# EAGLE design daqbeagle_shield (EAGLE 7.3.0)

## Sheet 1 of 4: BeagleBone
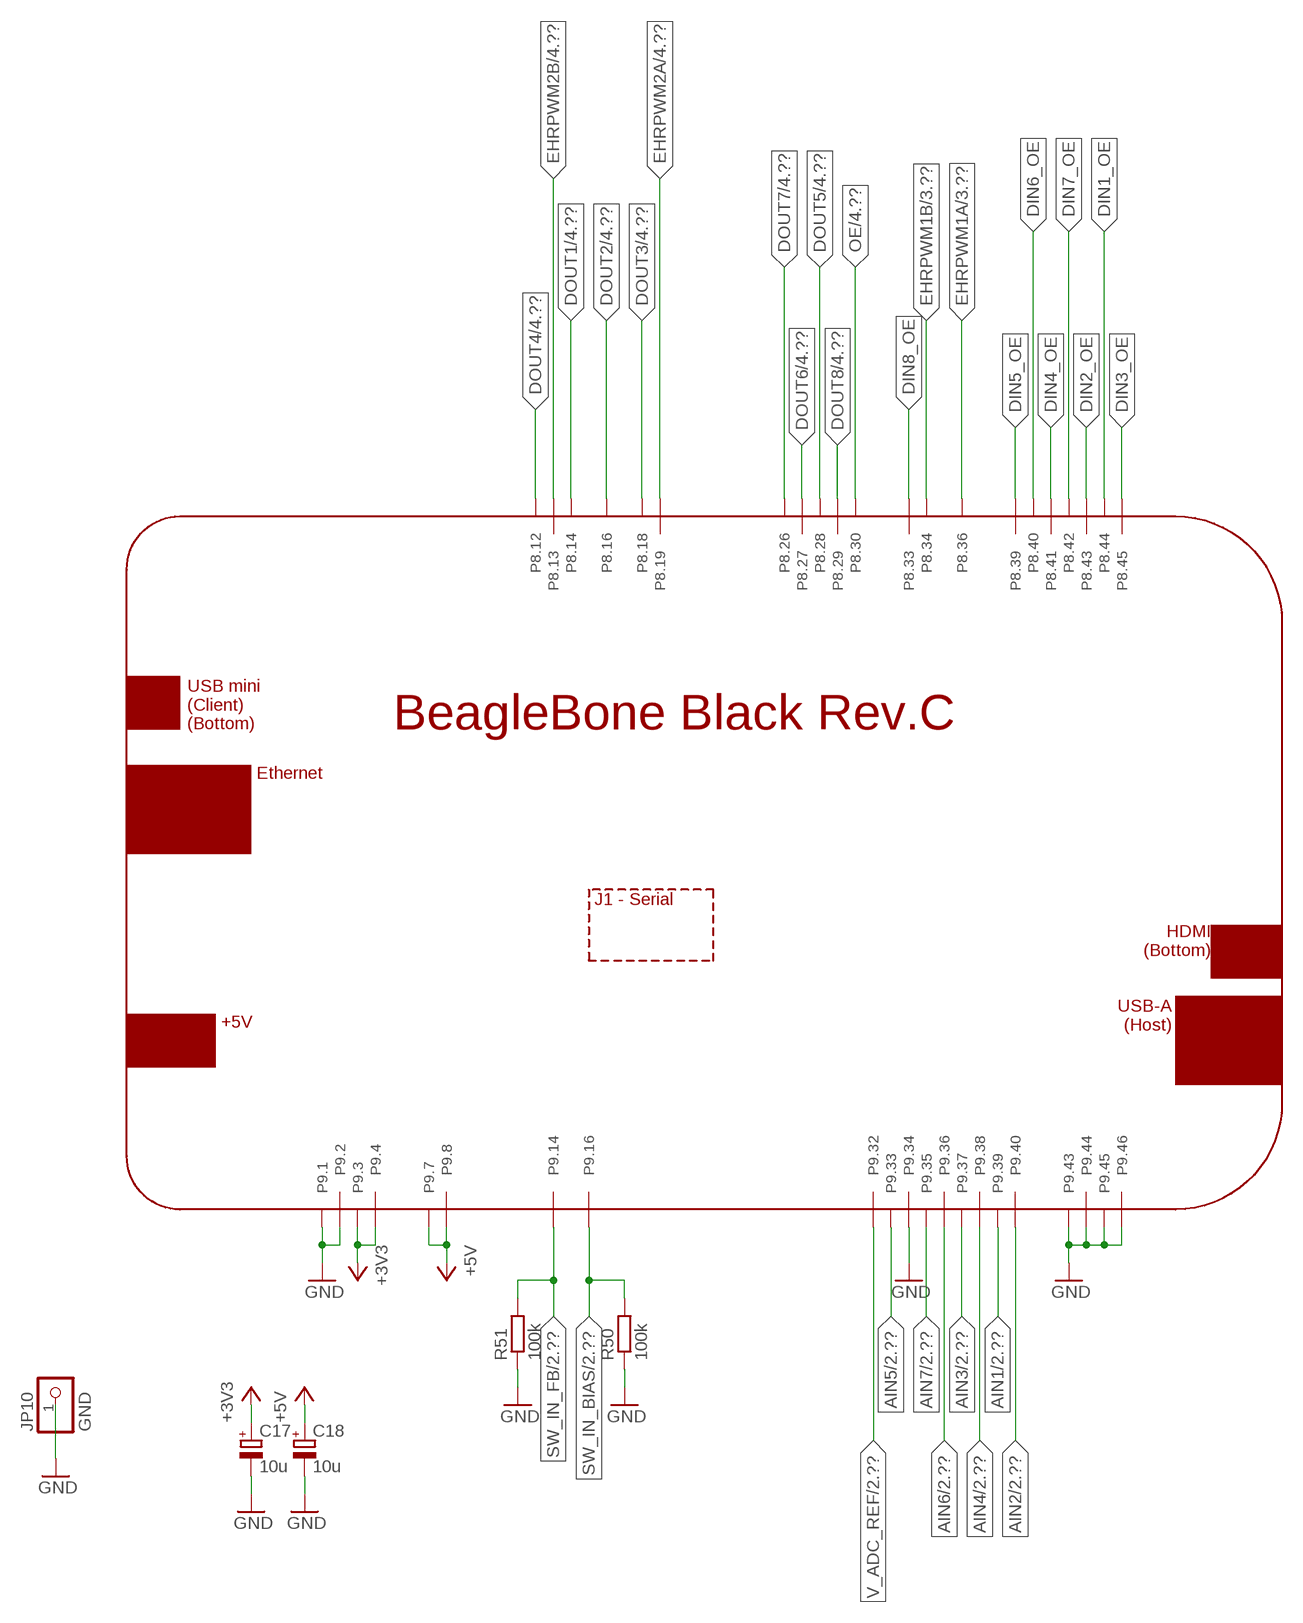
[diagram p0: schematic, sheet 1]

### Parts
C17  10u  CPOL-EUCT3216  [CT3216]
C18  10u  CPOL-EUCT6032  [CT6032]
JP10  GND  SOLDER_PAD  [PAD]
PCB1  BEAGLEBONE_BLACK  [BEAGLEBONE_BLACK]
R50  100k  R-EU_R0805  [R0805]
R51  100k  R-EU_R0805  [R0805]

### Nets
+3V3: C17.+ PCB1.P9.3 PCB1.P9.4 ; also sheet 4
+5V: C18.+ PCB1.P9.7 PCB1.P9.8 ; also sheet 2,3,4
AIN1: PCB1.P9.39 ; also sheet 2
AIN2: PCB1.P9.40 ; also sheet 2
AIN3: PCB1.P9.37 ; also sheet 2
AIN4: PCB1.P9.38 ; also sheet 2
AIN5: PCB1.P9.33 ; also sheet 2
AIN6: PCB1.P9.36 ; also sheet 2
AIN7: PCB1.P9.35 ; also sheet 2
DIN1_OE: PCB1.P8.44 ; also sheet 4
DIN2_OE: PCB1.P8.43 ; also sheet 4
DIN3_OE: PCB1.P8.45 ; also sheet 4
DIN4_OE: PCB1.P8.41 ; also sheet 4
DIN5_OE: PCB1.P8.39 ; also sheet 4
DIN6_OE: PCB1.P8.40 ; also sheet 4
DIN7_OE: PCB1.P8.42 ; also sheet 4
DIN8_OE: PCB1.P8.33 ; also sheet 4
DOUT1: PCB1.P8.14 ; also sheet 4
DOUT2: PCB1.P8.16 ; also sheet 4
DOUT3: PCB1.P8.18 ; also sheet 4
DOUT4: PCB1.P8.12 ; also sheet 4
DOUT5: PCB1.P8.28 ; also sheet 4
DOUT6: PCB1.P8.27 ; also sheet 4
DOUT7: PCB1.P8.26 ; also sheet 4
DOUT8: PCB1.P8.29 ; also sheet 4
EHRPWM1A: PCB1.P8.36 ; also sheet 3
EHRPWM1B: PCB1.P8.34 ; also sheet 3
EHRPWM2A: PCB1.P8.19 ; also sheet 4
EHRPWM2B: PCB1.P8.13 ; also sheet 4
GND: C17.- C18.- JP10.1 PCB1.P9.1 PCB1.P9.2 PCB1.P9.34 PCB1.P9.43 PCB1.P9.44 PCB1.P9.45 PCB1.P9.46 R50.1 R51.1 ; also sheet 2,3,4
OE: PCB1.P8.30 ; also sheet 4
SW_IN_BIAS: PCB1.P9.16 R50.2 ; also sheet 2
SW_IN_FB: PCB1.P9.14 R51.2 ; also sheet 2
V_ADC_REF: PCB1.P9.32 ; also sheet 2

## Sheet 2 of 4: Analog Inputs
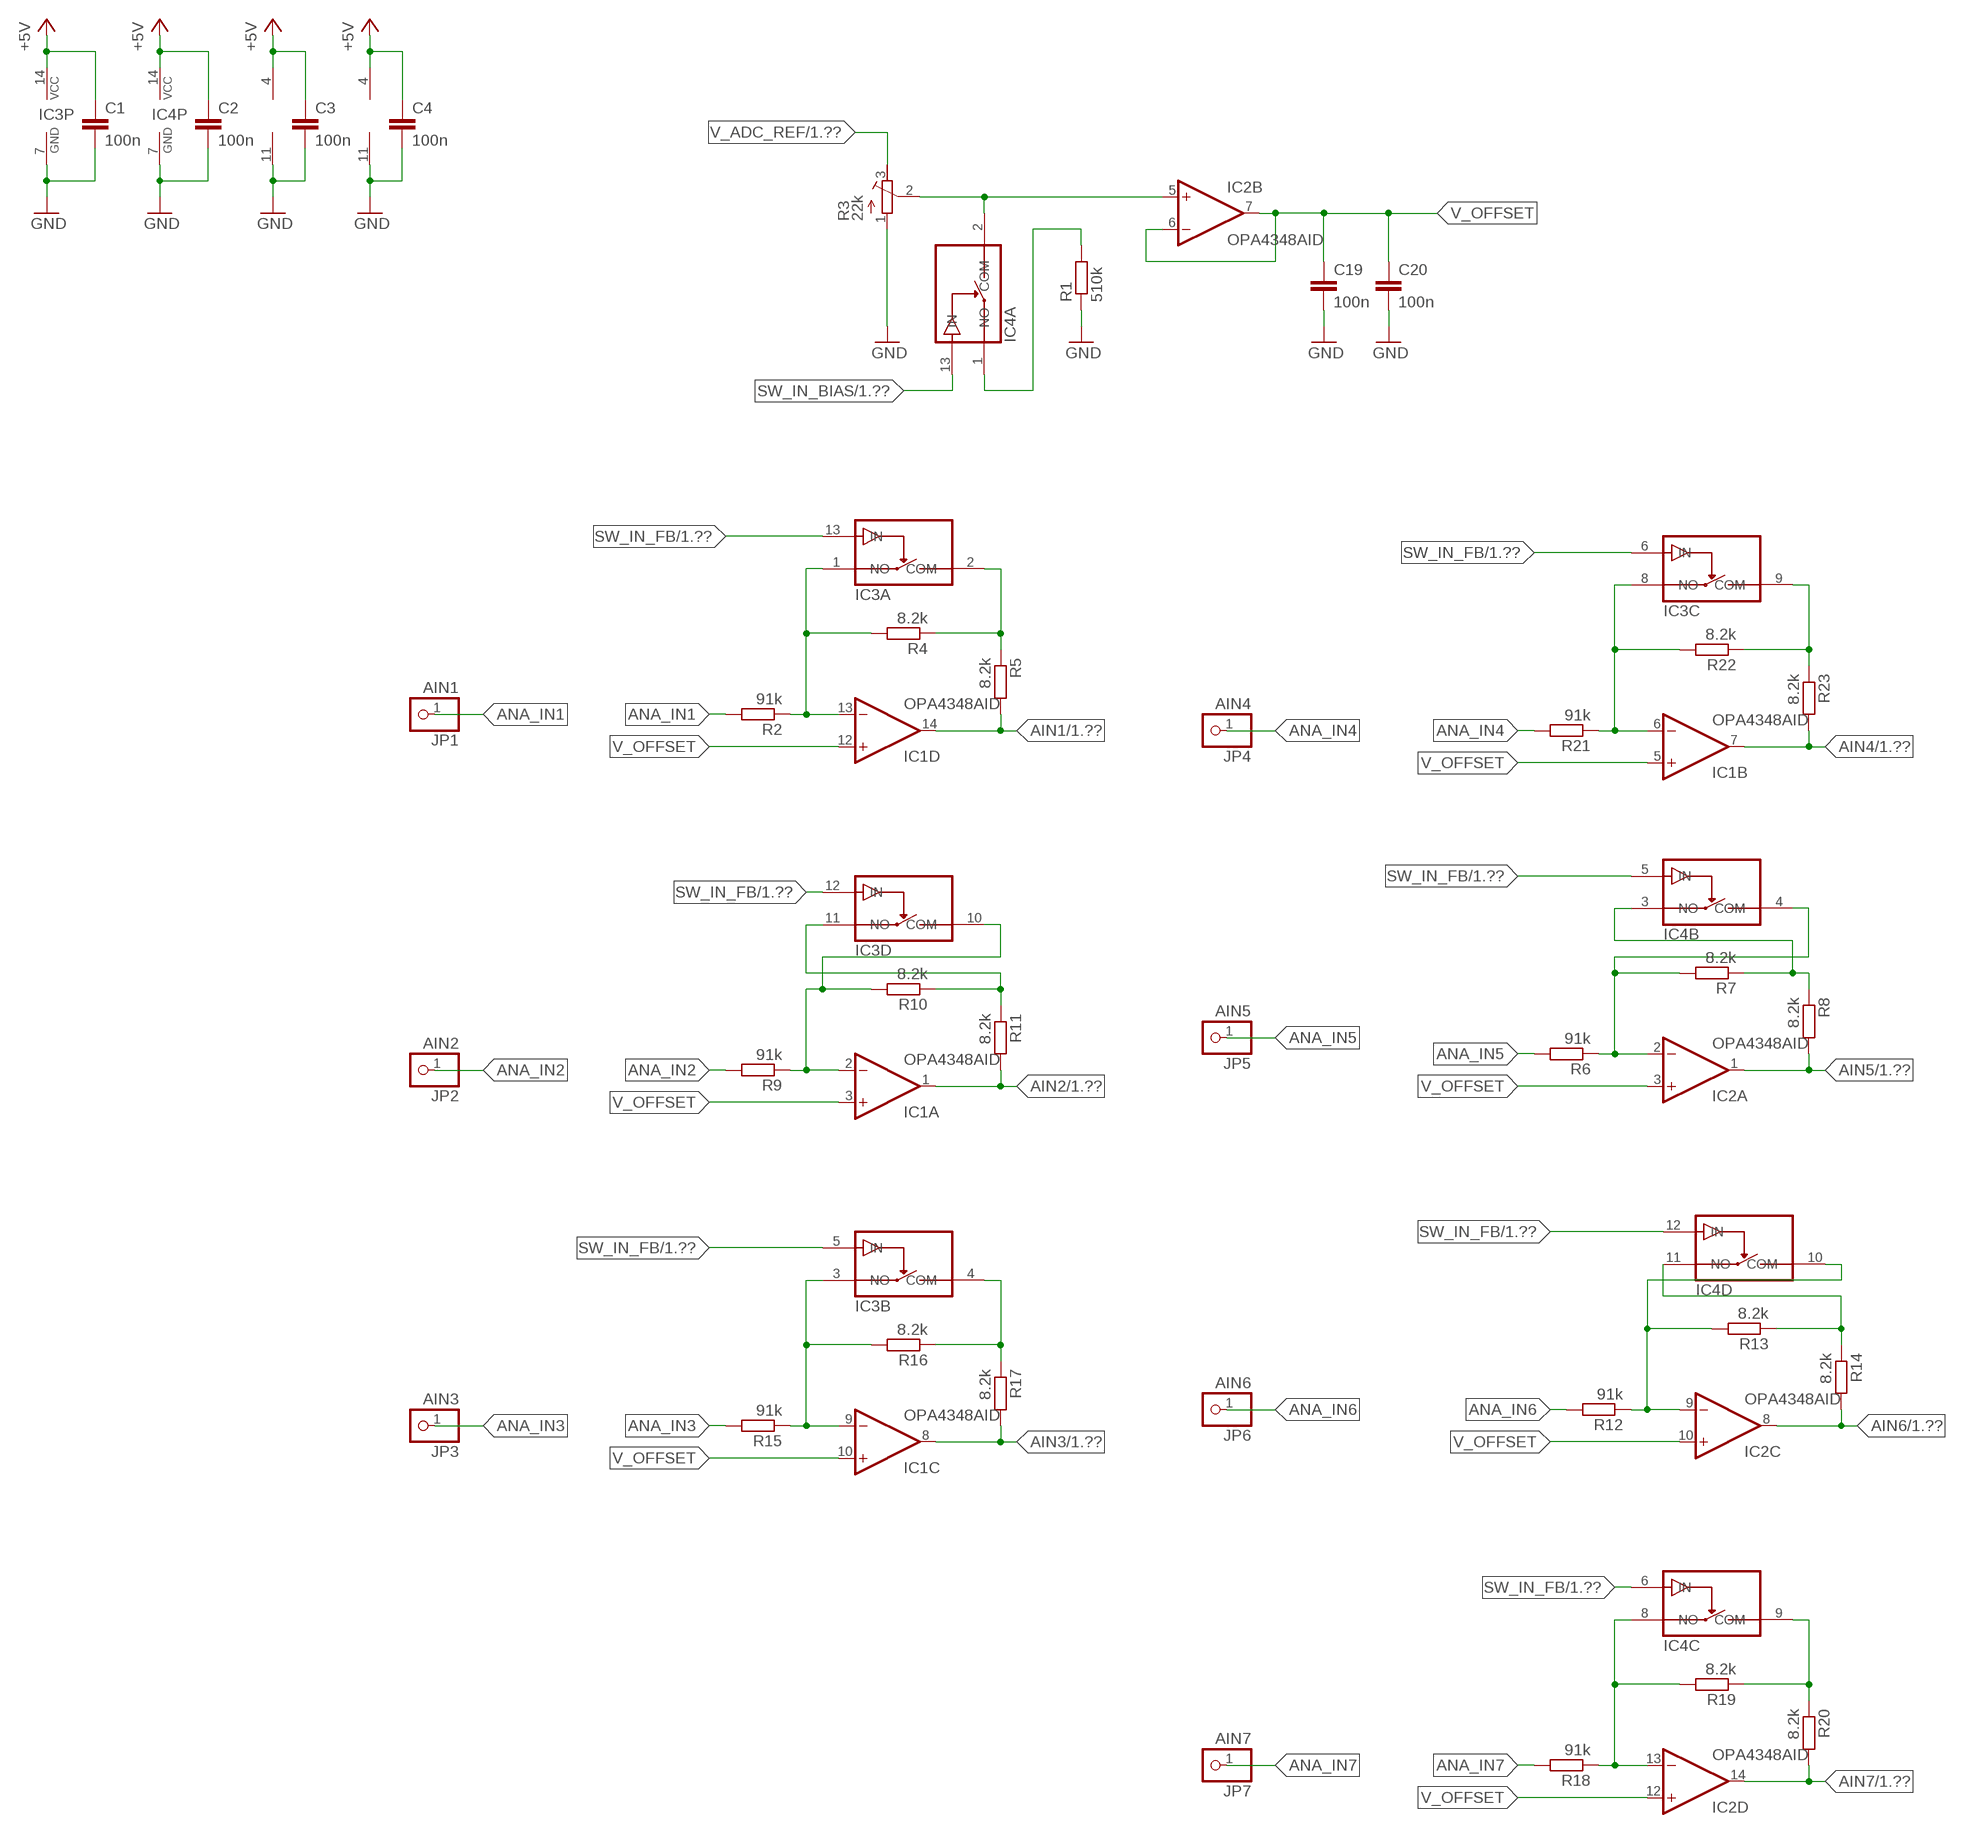
[diagram p1: schematic, sheet 2]

### Parts
C1  100n  C-EUC0805  [C0805]
C2  100n  C-EUC0805  [C0805]
C3  100n  C-EUC0805  [C0805]
C4  100n  C-EUC0805  [C0805]
C19  100n  C-EUC0805  [C0805]
C20  100n  C-EUC0805  [C0805]
IC1  OPA4348AID  [SO14]
IC2  OPA4348AID  [SO14]
IC3  TS12A44514PW  [TSSOP14]
IC4  TS12A44514PW  [TSSOP14]
JP1  AIN1  SOLDER_PAD  [PAD]
JP2  AIN2  SOLDER_PAD  [PAD]
JP3  AIN3  SOLDER_PAD  [PAD]
JP4  AIN4  SOLDER_PAD  [PAD]
JP5  AIN5  SOLDER_PAD  [PAD]
JP6  AIN6  SOLDER_PAD  [PAD]
JP7  AIN7  SOLDER_PAD  [PAD]
R1  510k  R-EU_R0603  [R0603]
R2  91k  R-EU_R0603  [R0603]
R3  22k  R-TRIMM  [RTRIM3296P]
R4  8.2k  R-EU_R0603  [R0603]
R5  8.2k  R-EU_R0603  [R0603]
R6  91k  R-EU_R0603  [R0603]
R7  8.2k  R-EU_R0603  [R0603]
R8  8.2k  R-EU_R0603  [R0603]
R9  91k  R-EU_R0603  [R0603]
R10  8.2k  R-EU_R0603  [R0603]
R11  8.2k  R-EU_R0603  [R0603]
R12  91k  R-EU_R0603  [R0603]
R13  8.2k  R-EU_R0603  [R0603]
R14  8.2k  R-EU_R0603  [R0603]
R15  91k  R-EU_R0603  [R0603]
R16  8.2k  R-EU_R0603  [R0603]
R17  8.2k  R-EU_R0603  [R0603]
R18  91k  R-EU_R0603  [R0603]
R19  8.2k  R-EU_R0603  [R0603]
R20  8.2k  R-EU_R0603  [R0603]
R21  91k  R-EU_R0603  [R0603]
R22  8.2k  R-EU_R0603  [R0603]
R23  8.2k  R-EU_R0603  [R0603]

### Nets
+5V: C1.1 C2.1 C3.1 C4.1 IC1.4(P:V+) IC2.4(P:V+) IC3.14(P:VCC) IC4.14(P:VCC) ; also sheet 1,3,4
AIN1: IC1.14(D:OUT) R5.2 ; also sheet 1
AIN2: IC1.1(A:OUT) R11.2 ; also sheet 1
AIN3: IC1.8(C:OUT) R17.2 ; also sheet 1
AIN4: IC1.7(B:OUT) R23.2 ; also sheet 1
AIN5: IC2.1(A:OUT) R8.2 ; also sheet 1
AIN6: IC2.8(C:OUT) R14.2 ; also sheet 1
AIN7: IC2.14(D:OUT) R20.2 ; also sheet 1
ANA_IN1: JP1.1 R2.2
ANA_IN2: JP2.1 R9.2
ANA_IN3: JP3.1 R15.2
ANA_IN4: JP4.1 R21.2
ANA_IN5: JP5.1 R6.2
ANA_IN6: JP6.1 R12.2
ANA_IN7: JP7.1 R18.2
GND: C1.2 C2.2 C3.2 C4.2 C19.2 C20.2 IC1.11(P:GND) IC2.11(P:GND) IC3.7(P:GND) IC4.7(P:GND) R1.1 R3.1(A) ; also sheet 1,3,4
N$1: IC2.5(B:+IN) IC4.2(A:COM) R3.2(S)
N$2: IC4.1(A:NO) R1.2
N$3: IC1.13(D:-IN) IC3.1(A:NO) R2.1 R4.2
N$4: IC2.2(A:-IN) IC4.4(B:COM) R6.1 R7.2
N$5: IC4.3(B:NO) R7.1 R8.1
N$6: IC3.2(A:COM) R4.1 R5.1
N$7: IC1.2(A:-IN) IC3.10(D:COM) R9.1 R10.2
N$8: IC3.11(D:NO) R10.1 R11.1
N$9: IC2.9(C:-IN) IC4.10(D:COM) R12.1 R13.2
N$10: IC4.11(D:NO) R13.1 R14.1
N$12: IC3.4(B:COM) R16.1 R17.1
N$13: IC2.13(D:-IN) IC4.8(C:NO) R18.1 R19.2
N$14: IC4.9(C:COM) R19.1 R20.1
N$15: IC1.6(B:-IN) IC3.8(C:NO) R21.1 R22.2
N$16: IC3.9(C:COM) R22.1 R23.1
N$99: IC1.9(C:-IN) IC3.3(B:NO) R15.1 R16.2
SW_IN_BIAS: IC4.13(A:IN) ; also sheet 1
SW_IN_FB: IC3.5(B:IN) IC3.6(C:IN) IC3.12(D:IN) IC3.13(A:IN) IC4.5(B:IN) IC4.6(C:IN) IC4.12(D:IN) ; also sheet 1
V_ADC_REF: R3.3(E) ; also sheet 1
V_OFFSET: C19.1 C20.1 IC1.3(A:+IN) IC1.5(B:+IN) IC1.10(C:+IN) IC1.12(D:+IN) IC2.3(A:+IN) IC2.6(B:-IN) IC2.7(B:OUT) IC2.10(C:+IN) IC2.12(D:+IN)

## Sheet 3 of 4: Analog Outputs
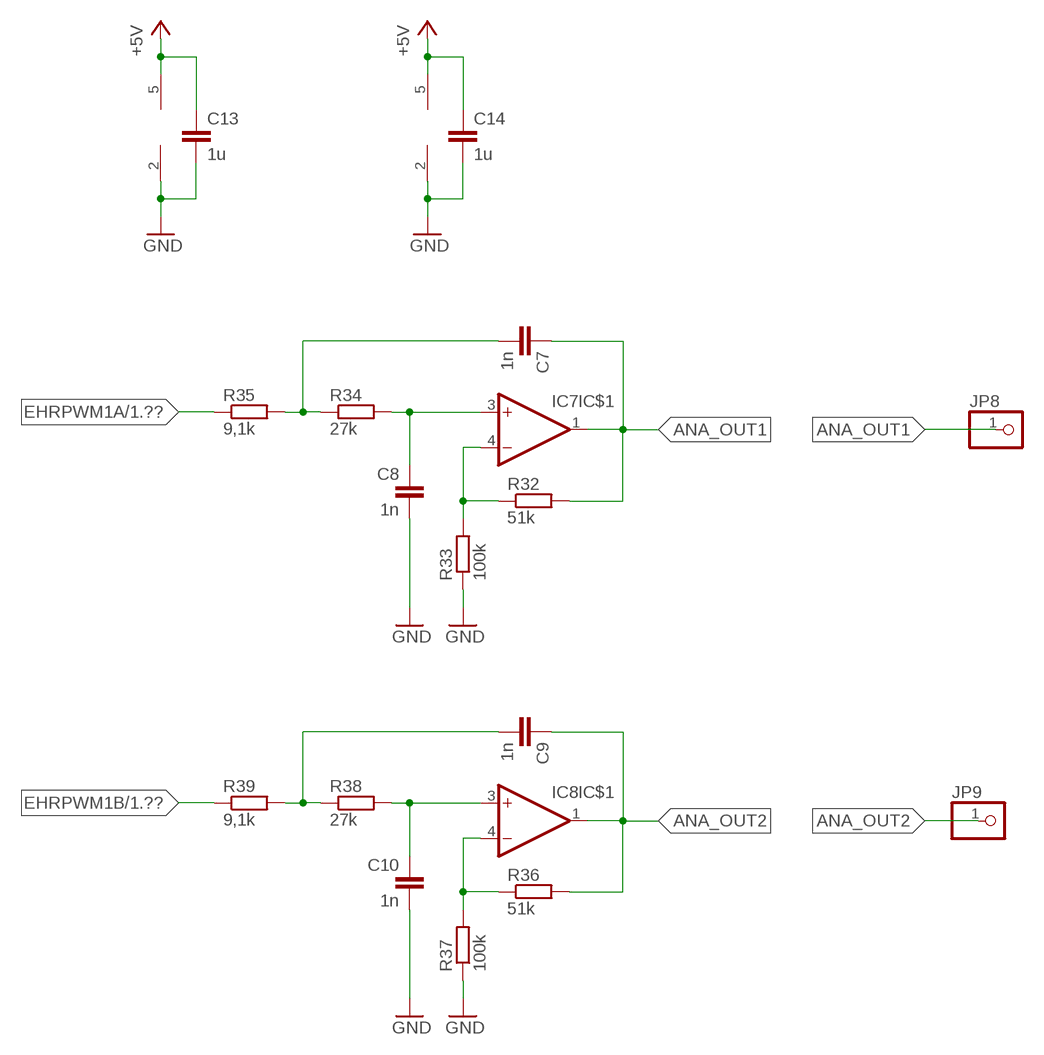
[diagram p2: schematic, sheet 3]

### Parts
C7  1n  C-EUC0805  [C0805]
C8  1n  C-EUC0805  [C0805]
C9  1n  C-EUC0805  [C0805]
C10  1n  C-EUC0805  [C0805]
C13  1u  C-EUC0805  [C0805]
C14  1u  C-EUC0805  [C0805]
IC7  OPA320  [SOT23-5L]
IC8  OPA320  [SOT23-5L]
JP8  SOLDER_PAD  [PAD]
JP9  SOLDER_PAD  [PAD]
R32  51k  R-EU_R0805  [R0805]
R33  100k  R-EU_R0603  [R0603]
R34  27k  R-EU_R0603  [R0603]
R35  9,1k  R-EU_R0805  [R0805]
R36  51k  R-EU_R0805  [R0805]
R37  100k  R-EU_R0603  [R0603]
R38  27k  R-EU_R0603  [R0603]
R39  9,1k  R-EU_R0805  [R0805]

### Nets
+5V: C13.1 C14.1 IC7.5(P:V+) IC8.5(P:V+) ; also sheet 1,2,4
ANA_OUT1: C7.1 IC7.1(IC$1:OUT) JP8.1 R32.2
ANA_OUT2: C9.1 IC8.1(IC$1:OUT) JP9.1 R36.2
EHRPWM1A: R35.1 ; also sheet 1
EHRPWM1B: R39.1 ; also sheet 1
GND: C8.2 C10.2 C13.2 C14.2 IC7.2(P:GND) IC8.2(P:GND) R33.1 R37.1 ; also sheet 1,2,4
N$25: IC7.4(IC$1:-IN) R32.1 R33.2
N$26: IC8.4(IC$1:-IN) R36.1 R37.2
N$27: C8.1 IC7.3(IC$1:+IN) R34.2
N$28: C7.2 R34.1 R35.2
N$29: C10.1 IC8.3(IC$1:+IN) R38.2
N$30: C9.2 R38.1 R39.2

## Sheet 4 of 4: Digital Inputs & Outputs / PWM Outputs
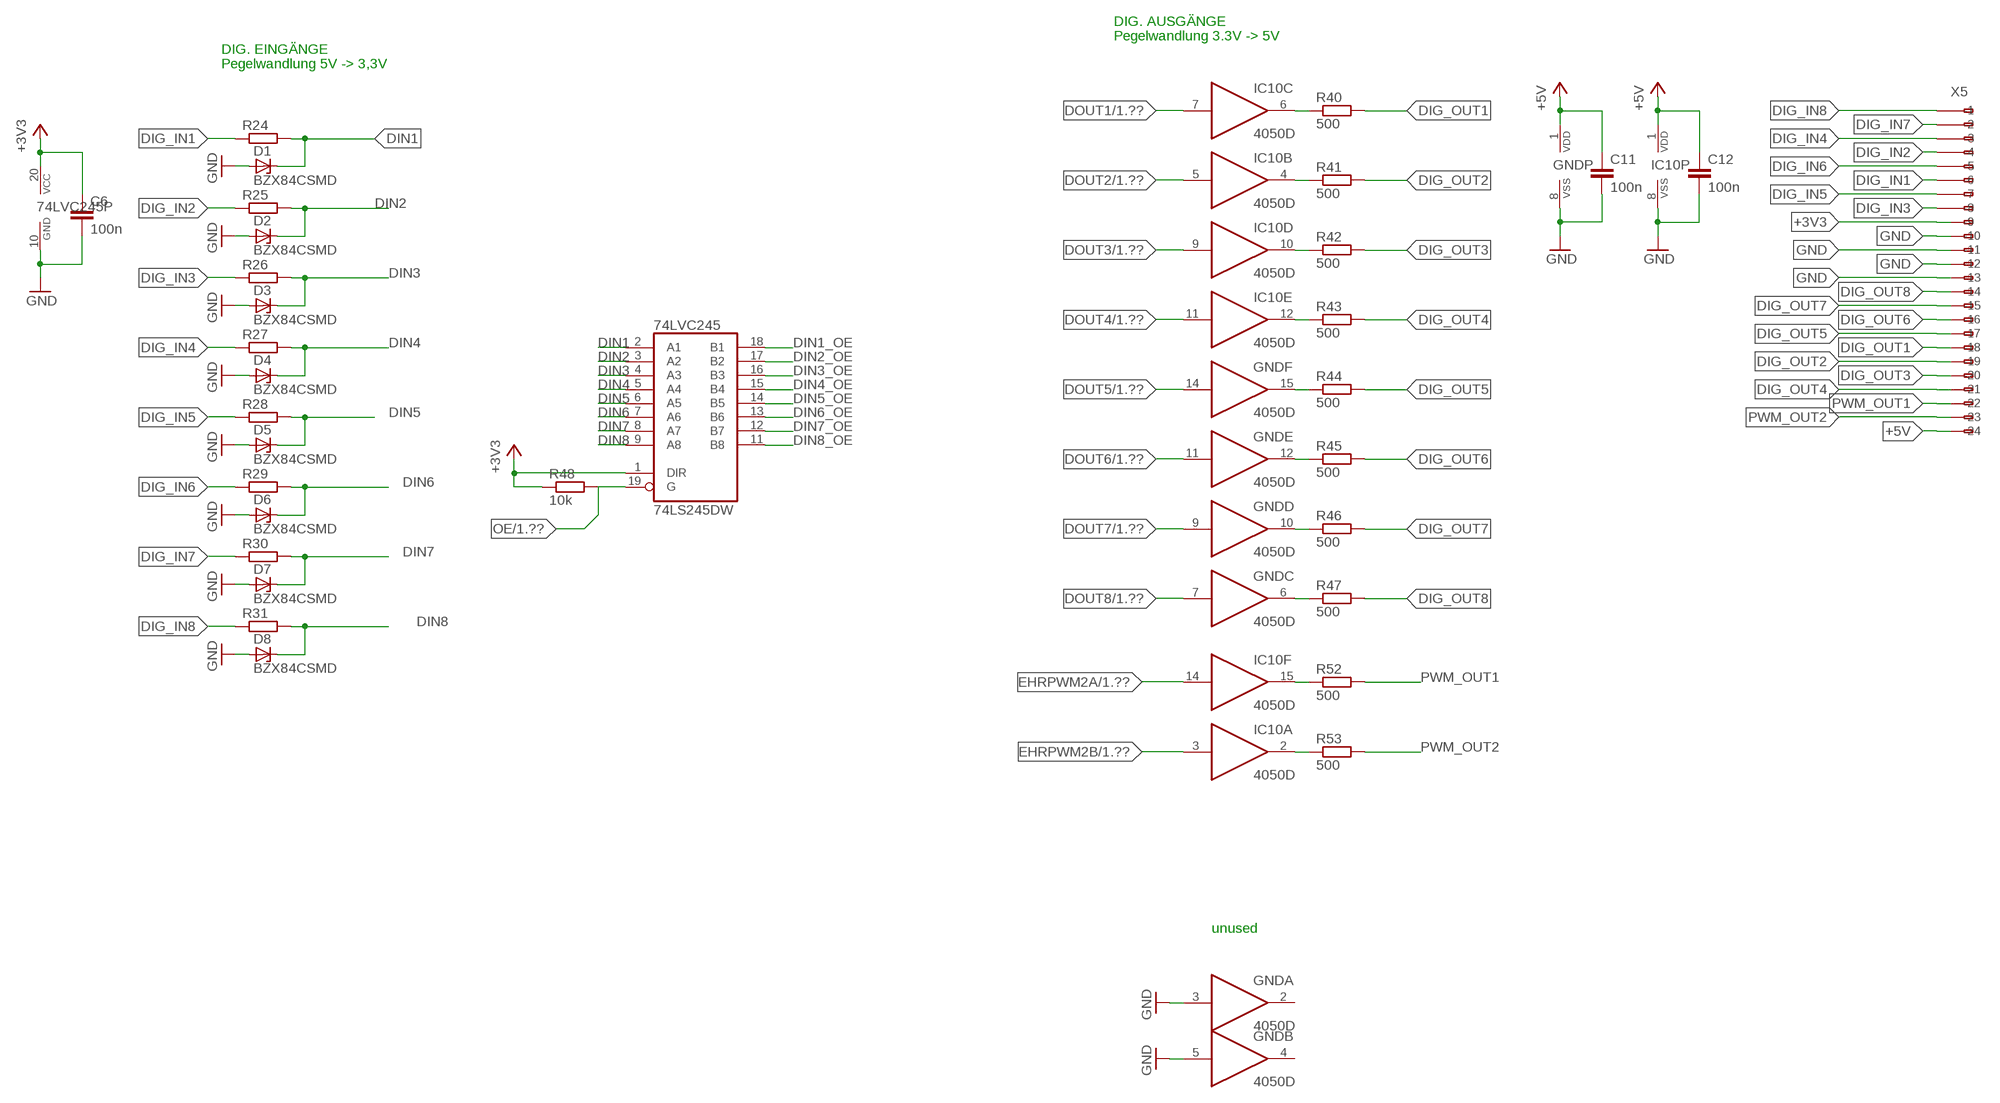
[diagram p3: schematic, sheet 4]

### Parts
74LVC245  74LS245DW  [SO20W]
C6  100n  C-EUC0805  [C0805]
C11  100n  C-EUC0805  [C0805]
C12  100n  C-EUC0805  [C0805]
D1  BZX84CSMD  [TO236]
D2  BZX84CSMD  [TO236]
D3  BZX84CSMD  [TO236]
D4  BZX84CSMD  [TO236]
D5  BZX84CSMD  [TO236]
D6  BZX84CSMD  [TO236]
D7  BZX84CSMD  [TO236]
D8  BZX84CSMD  [TO236]
GND  4050D  [SO16]
IC10  4050D  [SO16]
R24  R-EU_R0805  [R0805]
R25  R-EU_R0805  [R0805]
R26  R-EU_R0805  [R0805]
R27  R-EU_R0805  [R0805]
R28  R-EU_R0805  [R0805]
R29  R-EU_R0805  [R0805]
R30  R-EU_R0805  [R0805]
R31  R-EU_R0805  [R0805]
R40  500  R-EU_R0805  [R0805]
R41  500  R-EU_R0805  [R0805]
R42  500  R-EU_R0805  [R0805]
R43  500  R-EU_R0805  [R0805]
R44  500  R-EU_R0805  [R0805]
R45  500  R-EU_R0805  [R0805]
R46  500  R-EU_R0805  [R0805]
R47  500  R-EU_R0805  [R0805]
R48  10k  R-EU_R0805  [R0805]
R52  500  R-EU_R0805  [R0805]
R53  500  R-EU_R0805  [R0805]
X5  233-124  [233-124]

### Nets
+3V3: 74LVC245.1(DIR) 74LVC245.20(VCC) C6.1 R48.1 X5.A9(-9) X5.B9(B-9) ; also sheet 1
+5V: C11.1 C12.1 GND.1(P:VDD) IC10.1(P:VDD) X5.A24(-24) X5.B24(B-24) ; also sheet 1,2,3
DIG_IN1: R24.1 X5.A6(-6)
DIG_IN2: R25.1 X5.A4(-4)
DIG_IN3: R26.1 X5.A8(-8)
DIG_IN4: R27.1 X5.A3(-3)
DIG_IN5: R28.1 X5.A7(-7)
DIG_IN6: R29.1 X5.A5(-5)
DIG_IN7: R30.1 X5.A2(-2)
DIG_IN8: R31.1 X5.A1(-1)
DIG_OUT1: R40.2 X5.A18(-18) X5.B18(B-18)
DIG_OUT2: R41.2 X5.A19(-19) X5.B19(B-19)
DIG_OUT3: R42.2 X5.A20(-20) X5.B20(B-20)
DIG_OUT4: R43.2 X5.A21(-21) X5.B21(B-21)
DIG_OUT5: R44.2 X5.A17(-17) X5.B17(B-17)
DIG_OUT6: R45.2 X5.A16(-16) X5.B16(B-16)
DIG_OUT7: R46.2 X5.A15(-15) X5.B15(B-15)
DIG_OUT8: R47.2 X5.A14(-14) X5.B14(B-14)
DIN1: 74LVC245.2(A1) D1.C R24.2
DIN1_OE: 74LVC245.18(B1) ; also sheet 1
DIN2: 74LVC245.3(A2) D2.C R25.2
DIN2_OE: 74LVC245.17(B2) ; also sheet 1
DIN3: 74LVC245.4(A3) D3.C R26.2
DIN3_OE: 74LVC245.16(B3) ; also sheet 1
DIN4: 74LVC245.5(A4) D4.C R27.2
DIN4_OE: 74LVC245.15(B4) ; also sheet 1
DIN5: 74LVC245.6(A5) D5.C R28.2
DIN5_OE: 74LVC245.14(B5) ; also sheet 1
DIN6: 74LVC245.7(A6) D6.C R29.2
DIN6_OE: 74LVC245.13(B6) ; also sheet 1
DIN7: 74LVC245.8(A7) D7.C R30.2
DIN7_OE: 74LVC245.12(B7) ; also sheet 1
DIN8: 74LVC245.9(A8) D8.C R31.2
DIN8_OE: 74LVC245.11(B8) ; also sheet 1
DOUT1: IC10.7(C:I) ; also sheet 1
DOUT2: IC10.5(B:I) ; also sheet 1
DOUT3: IC10.9(D:I) ; also sheet 1
DOUT4: IC10.11(E:I) ; also sheet 1
DOUT5: GND.14(F:I) ; also sheet 1
DOUT6: GND.11(E:I) ; also sheet 1
DOUT7: GND.9(D:I) ; also sheet 1
DOUT8: GND.7(C:I) ; also sheet 1
EHRPWM2A: IC10.14(F:I) ; also sheet 1
EHRPWM2B: IC10.3(A:I) ; also sheet 1
GND: 74LVC245.10(GND) C6.2 C11.2 C12.2 D1.A D2.A D3.A D4.A D5.A D6.A D7.A D8.A GND.3(A:I) GND.5(B:I) GND.8(P:VSS) IC10.8(P:VSS) X5.A10(-10) X5.A11(-11) X5.A12(-12) X5.A13(-13) X5.B10(B-10) X5.B11(B-11) X5.B12(B-12) X5.B13(B-13) ; also sheet 1,2,3
N$32: IC10.6(C:O) R40.1
N$33: IC10.4(B:O) R41.1
N$34: IC10.10(D:O) R42.1
N$35: IC10.12(E:O) R43.1
N$36: GND.15(F:O) R44.1
N$37: GND.12(E:O) R45.1
N$38: GND.10(D:O) R46.1
N$39: GND.6(C:O) R47.1
N$41: IC10.15(F:O) R52.1
N$42: IC10.2(A:O) R53.1
OE: 74LVC245.19(G) R48.2 ; also sheet 1
PWM_OUT1: R52.2 X5.A22(-22) X5.B22(B-22)
PWM_OUT2: R53.2 X5.A23(-23) X5.B23(B-23)
Unconnected: GND.2(A:O) GND.4(B:O) X5.B1(B-1) X5.B2(B-2) X5.B3(B-3) X5.B4(B-4) X5.B5(B-5) X5.B6(B-6) X5.B7(B-7) X5.B8(B-8)

### Notes on the sheet
- DIG. AUSGÄNGE
  Pegelwandlung 3.3V -> 5V
- DIG. EINGÄNGE
  Pegelwandlung 5V -> 3,3V
- unused

## Library data of the parts
74LVC245 = 74xx-eu:74*245: Octal BUS TRANSCEIVER, 3-state
C1-C4 C6-C14 C19 C20 = rcl:C-EU: CAPACITOR, European symbol
C17 C18 = resistor:CPOL-EU: POLARIZED CAPACITOR, European symbol
D1-D8 = diode:BZX84CSMD: Z DIODE
GND IC10 = 40xx:4050: Hex non-inverting BUFFER
IC1 IC2 = IC_libraries:OPA4348: Low Power Low Offset Voltage Quad Comparators with open collector; LM139/LM239/LM339/LM2901/LM3302
IC3 IC4 = IC_libraries:TS12A44514: Quad bilateral ANALOG SWITCH
IC7 IC8 = BBB_libraries:OPA320
JP1-JP10 = BBB_libraries:SOLDER_PAD: PIN HEADER
PCB1 = e14_BeagleBoneBlack_RevA:BEAGLEBONE_BLACK: BeagleBone Black Rev. C device with associated package to help create a cape. NOTE: Other considerations when making a Cape (mechanical allowances for tall BBB components, EEPROM requirements, and power ratings) can be found in the BBB System Reference Manual More information available at http://www.element14.com/community/community/designcenter/single-board-computers/next-gen_beaglebone
R1 R2 R4-R48 R50-R53 = rcl:R-EU_: RESISTOR, European symbol
R3 = BBB_libraries:R-TRIMM
X5 = con-wago255:233-124: WAGO; MPN: 233-124; OC_FARNELL: unknown; OC_NEWARK: 28K9056

## Net classes
0 default: clearance 0.205 mm

## Board
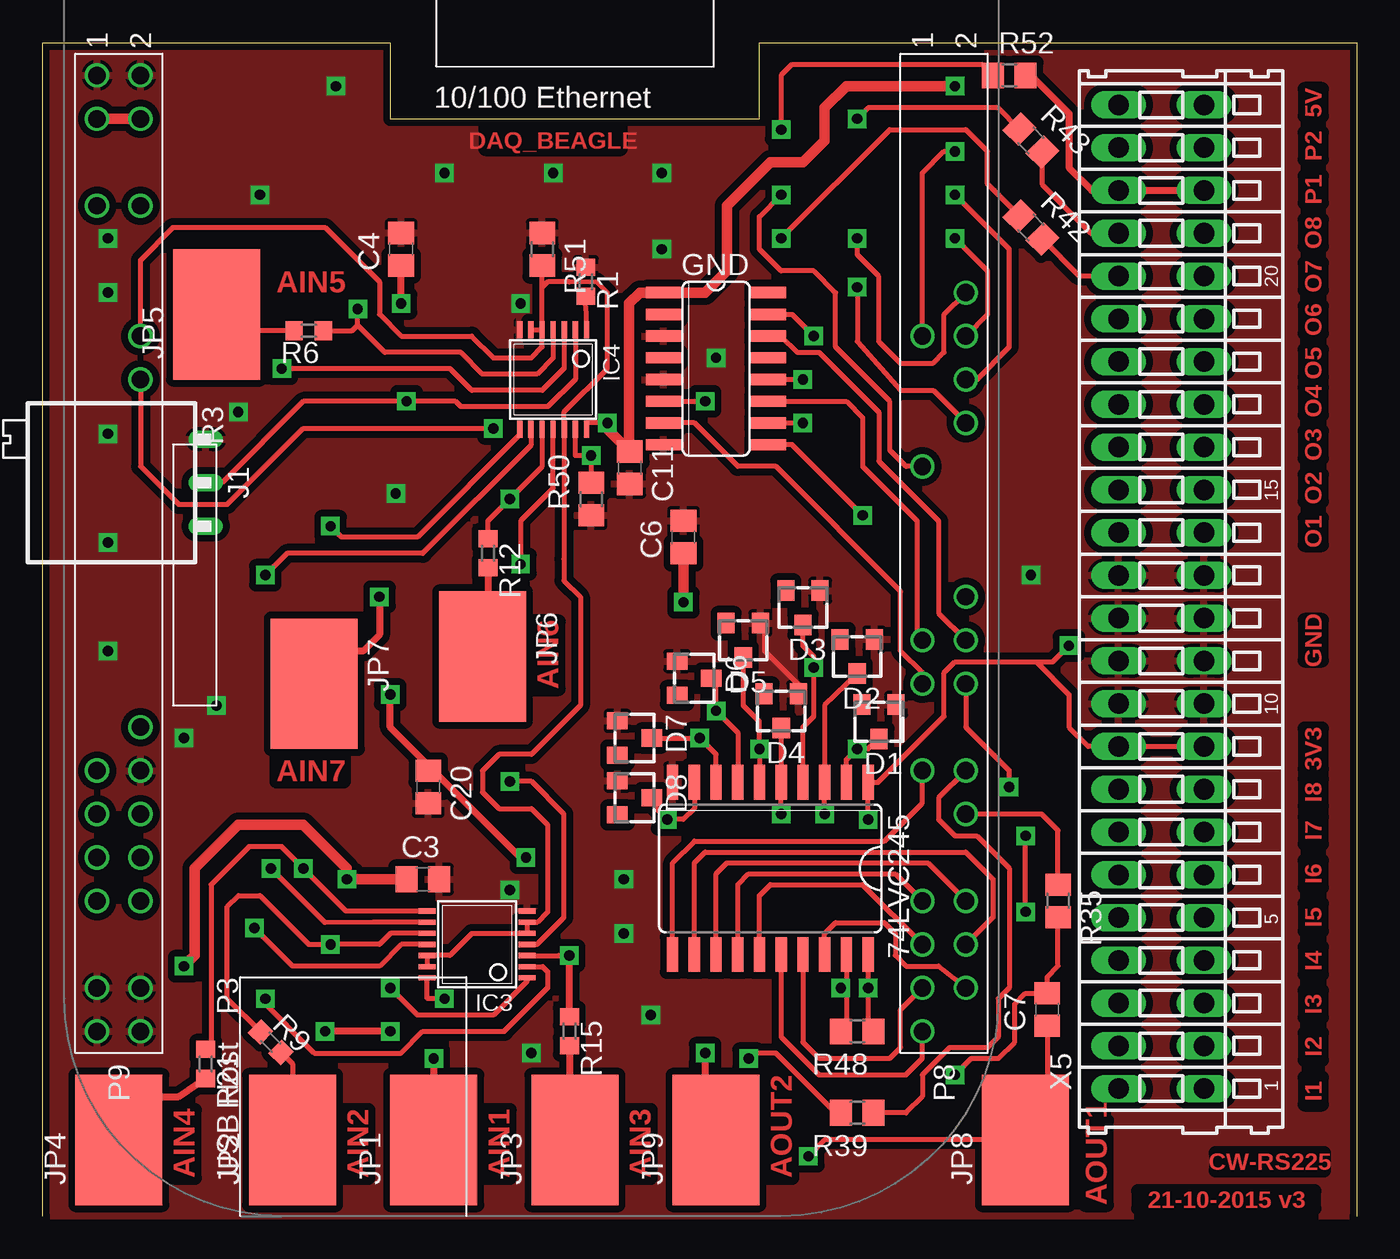
[diagram p4: board, top side]
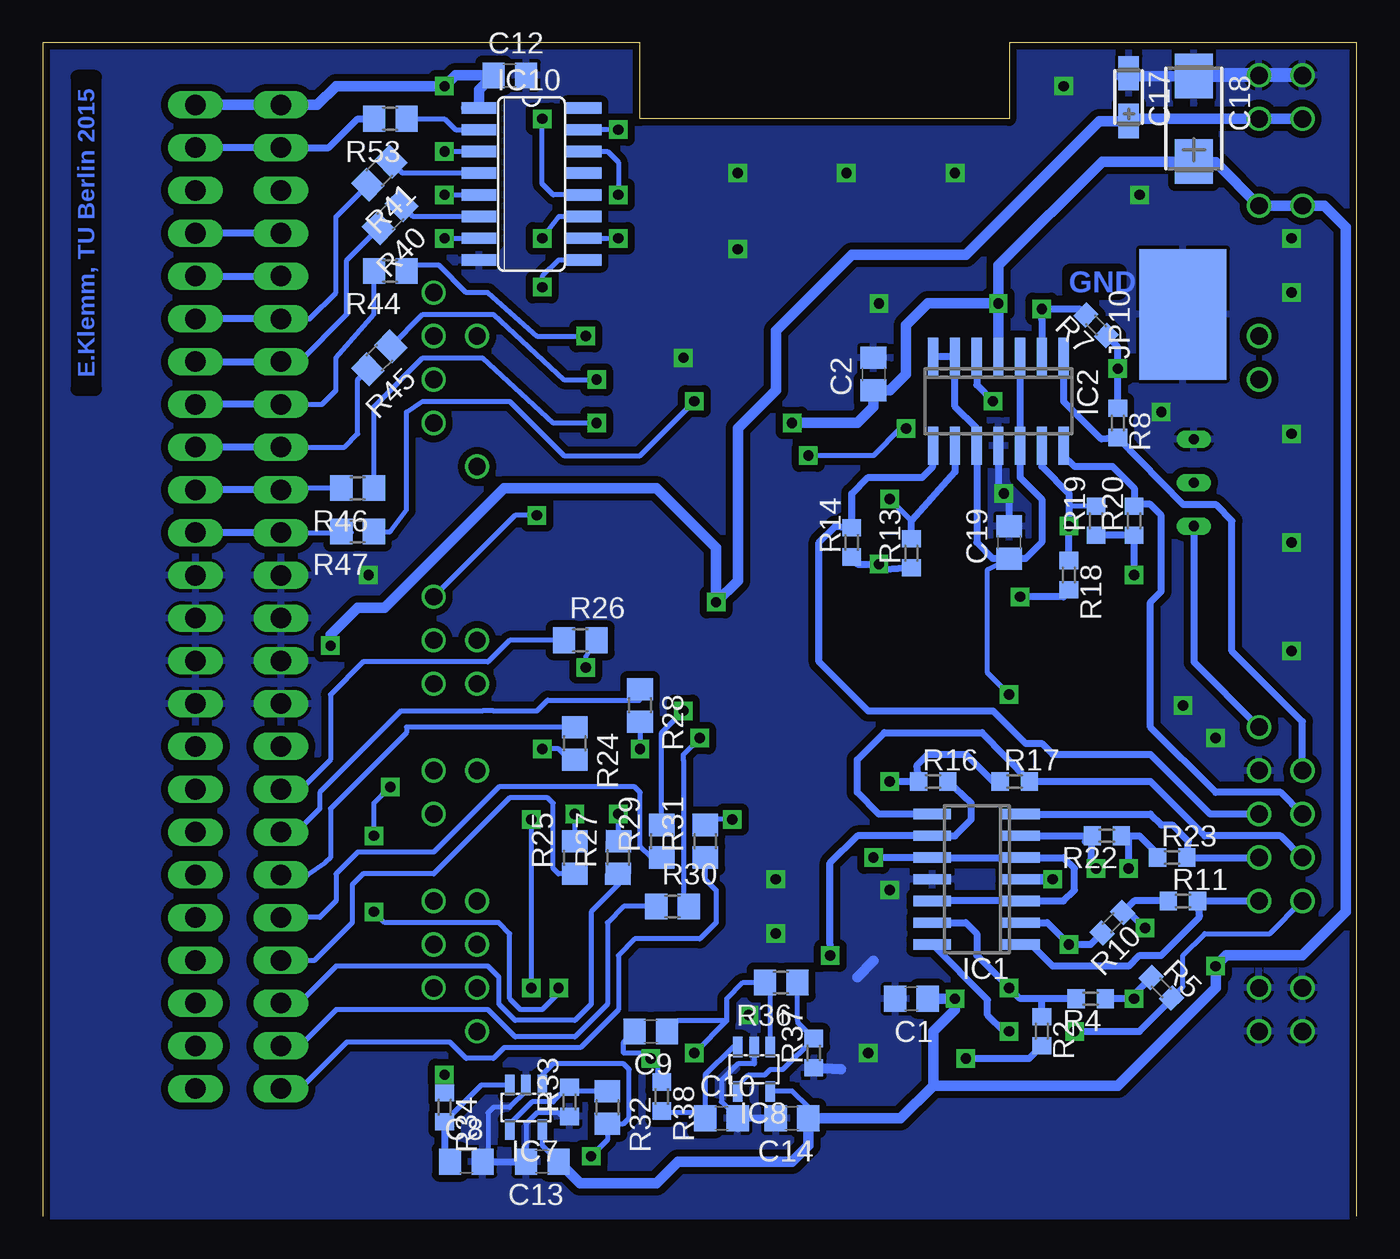
[diagram p5: board, bottom side, seen from below]

Size 76.83 x 68.58 mm. Coordinates in mm from the lower left corner, seen from the top.
Outline: 76.83,0 76.83,68.58 41.91,68.58 41.91,64.13 20.32,64.13 20.32,68.58 0,68.58 0,0
Copper layers (1*16): Top 0.035mm / dielectric 1.5mm / Bottom 0.035mm
Design rules "PCB-POOL Standard": minimum track width 0.15mm, minimum drill 0.3mm, track to track 0.15mm, track to pad 0.15mm, pad to pad 0.15mm, via to via 0.15mm, smd to smd 0.15mm, copper to edge 0.3mm, drill to drill 0.2mm, minimum pad ring 0.2mm, minimum via ring 0.15mm, stop-mask expansion 0.075mm, vias tented up to drill 0mil, thermal gap 0.2mm

### Footprints (pad centres in the part's own frame; a part is rotated, then mirrored left to right if it is on the bottom)
SO20W = smd 0.66 x 2.032: 1 -5.715,-5.029; 2 -4.445,-5.029; 3 -3.175,-5.029; 4 -1.905,-5.029; 5 -0.635,-5.029; 6 0.635,-5.029; 7 1.905,-5.029; 8 3.175,-5.029; 9 4.445,-5.029; 10 5.715,-5.029; 11 5.715,5.029; 12 4.445,5.029; 13 3.175,5.029; 14 1.905,5.029; 15 0.635,5.029; 16 -0.635,5.029; 17 -1.905,5.029; 18 -3.175,5.029; 19 -4.445,5.029; 20 -5.715,5.029
C0805 = smd 1.3 x 1.5: 1 -0.95,0; 2 0.95,0
CT3216 = smd 2 x 1.2: + 1.4,0; - -1.4,0
CT6032 = smd 2.6 x 2.2: + 2.5,0; - -2.5,0
TO236 = smd 1 x 1.2: A -1,-1; C 0,1; NC 1,-1
SO16 = smd 0.66 x 2.032: 1 -4.445,-3.073; 2 -3.175,-3.073; 3 -1.905,-3.073; 4 -0.635,-3.073; 5 0.635,-3.073; 6 1.905,-3.073; 7 3.175,-3.073; 8 4.445,-3.073; 9 4.445,3.073; 10 3.175,3.073; 11 1.905,3.073; 12 0.635,3.073; 13 -0.635,3.073; 14 -1.905,3.073; 15 -3.175,3.073; 16 -4.445,3.073
SO14 = smd 0.6 x 2.2: 1 -3.81,-2.6; 2 -2.54,-2.6; 3 -1.27,-2.6; 4 0,-2.6; 5 1.27,-2.6; 6 2.54,-2.6; 7 3.81,-2.6; 8 3.81,2.6; 9 2.54,2.6; 10 1.27,2.6; 11 0,2.6; 12 -1.27,2.6; 13 -2.54,2.6; 14 -3.81,2.6
TSSOP14 = smd 0.305 x 0.991: 1 -1.95,-2.918; 2 -1.3,-2.918; 3 -0.65,-2.918; 4 0,-2.918; 5 0.65,-2.918; 6 1.3,-2.918; 7 1.95,-2.918; 8 1.95,2.918; 9 1.3,2.918; 10 0.65,2.918; 11 0,2.918; 12 -0.65,2.918; 13 -1.3,2.918; 14 -1.95,2.918
SOT23-5L = smd 0.55 x 1.2: 1 -0.95,-1.3; 2 0,-1.3; 3 0.95,-1.3; 4 0.95,1.3; 5 -0.95,1.3
PAD = smd 7.62 x 5.08: 1 0,0
BEAGLEBONE_BLACK = drill 1.016: P8.12 32.385,52.705; P8.13 34.925,50.165; P8.14 34.925,52.705; P8.16 37.465,52.705; P8.18 40.005,52.705; P8.19 42.545,50.165; P8.26 50.165,52.705; P8.27 52.705,50.165; P8.28 52.705,52.705; P8.29 55.245,50.165; P8.30 55.245,52.705; P8.33 60.325,50.165; P8.34 60.325,52.705; P8.36 62.865,52.705; P8.39 67.945,50.165; P8.40 67.945,52.705; P8.41 70.485,50.165; P8.42 70.485,52.705; P8.43 73.025,50.165; P8.44 73.025,52.705; P8.45 75.565,50.165; P9.1 19.685,1.905; P9.2 19.685,4.445; P9.3 22.225,1.905; P9.4 22.225,4.445; P9.7 27.305,1.905; P9.8 27.305,4.445; P9.14 34.925,4.445; P9.16 37.465,4.445; P9.32 57.785,4.445; P9.33 60.325,1.905; P9.34 60.325,4.445; P9.35 62.865,1.905; P9.36 62.865,4.445; P9.37 65.405,1.905; P9.38 65.405,4.445; P9.39 67.945,1.905; P9.40 67.945,4.445; P9.43 73.025,1.905; P9.44 73.025,4.445; P9.45 75.565,1.905; P9.46 75.565,4.445
R0603 = smd 1 x 1.1: 1 -0.85,0; 2 0.85,0
RTRIM3296P = drill 0.61 long: 1 -5.715,-2.54; 2 -5.715,0; 3 -5.715,2.54
R0805 = smd 1.3 x 1.5: 1 -0.95,0; 2 0.95,0
233-124 = drill 1.2 long: A1 -28.75,2.5; A2 -26.25,2.5; A3 -23.75,2.5; A4 -21.25,2.5; A5 -18.75,2.5; A6 -16.25,2.5; A7 -13.75,2.5; A8 -11.25,2.5; A9 -8.75,2.5; A10 -6.25,2.5; A11 -3.75,2.5; A12 -1.25,2.5; A13 1.25,2.5; A14 3.75,2.5; A15 6.25,2.5; A16 8.75,2.5; A17 11.25,2.5; A18 13.75,2.5; A19 16.25,2.5; A20 18.75,2.5; A21 21.25,2.5; A22 23.75,2.5; A23 26.25,2.5; A24 28.75,2.5; B1 -28.75,-2.5; B2 -26.25,-2.5; B3 -23.75,-2.5; B4 -21.25,-2.5; B5 -18.75,-2.5; B6 -16.25,-2.5; B7 -13.75,-2.5; B8 -11.25,-2.5; B9 -8.75,-2.5; B10 -6.25,-2.5; B11 -3.75,-2.5; B12 -1.25,-2.5; B13 1.25,-2.5; B14 3.75,-2.5; B15 6.25,-2.5; B16 8.75,-2.5; B17 11.25,-2.5; B18 13.75,-2.5; B19 16.25,-2.5; B20 18.75,-2.5; B21 21.25,-2.5; B22 23.75,-2.5; B23 26.25,-2.5; B24 28.75,-2.5

### Placement (x,y rotation side)
74LVC245  42.55,20.32 180 top
C1  26.04,12.7 180 bottom
C2  28.26,49.21 90 bottom
C3  22.22,19.69 0 top
C4  20.95,56.52 90 top
C6  37.47,39.69 90 top
C7  58.74,12.06 90 top
C8  52.07,3.17 0 bottom
C9  41.28,10.8 180 bottom
C10  37.15,5.72 0 bottom
C11  34.33,43.74 270 top
C12  49.53,66.67 0 bottom
C13  47.62,3.17 180 bottom
C14  33.02,5.72 180 bottom
C17  13.33,65.41 270 bottom
C18  9.53,64.13 270 bottom
C19  20.32,39.37 90 bottom
C20  22.54,25.08 270 top
D1  48.9,28.89 180 top
D2  47.62,32.7 180 top
D3  44.45,35.56 180 top
D4  43.18,29.53 180 top
D5  40.96,33.66 180 top
D6  38.1,31.43 270 top
D7  34.61,27.94 270 top
D8  34.61,24.45 270 top
GND  39.37,49.53 270 top
IC1  22.22,19.69 90 bottom
IC2  20.95,47.62 180 bottom
IC3  25.4,15.88 90 top
IC4  29.84,48.89 180 top
IC7  48.58,6.35 180 bottom
IC8  35.24,8.57 180 bottom
IC10  48.26,60.33 270 bottom
JP1  22.86,4.44 90 top
JP2  14.61,4.44 90 top
JP3  31.11,4.44 90 top
JP4  4.45,4.44 90 top
JP5  10.16,52.7 90 top
JP6  25.72,32.7 270 top
JP7  15.88,31.12 270 top
JP8  57.47,4.44 90 top
JP9  39.37,4.44 90 top
JP10  10.16,52.7 90 bottom
PCB1  1.27,86.36 270 top
R1  31.75,54.61 270 top
R2  18.41,10.8 270 bottom
R3  3.81,42.86 180 top
R4  15.56,12.7 180 bottom
R5  11.43,13.33 315 bottom
R6  15.56,51.75 180 top
R7  15.24,52.07 135 bottom
R8  13.97,46.35 270 bottom
R9  13.33,10.16 315 top
R10  14.29,17.14 225 bottom
R11  10.16,18.42 0 bottom
R12  26.04,38.73 270 top
R13  26.04,38.73 90 bottom
R14  29.53,39.37 90 bottom
R15  30.8,10.8 270 top
R16  24.77,25.4 0 bottom
R17  20,25.4 0 bottom
R18  16.83,37.46 270 bottom
R19  15.24,40.64 90 bottom
R20  13.02,40.64 90 bottom
R21  9.53,8.89 270 top
R22  14.61,22.22 180 bottom
R23  10.79,20.95 0 bottom
R24  45.72,27.62 270 bottom
R25  45.72,20.95 90 bottom
R26  45.4,33.66 0 bottom
R27  43.18,20.95 89.1 bottom
R28  41.91,29.84 270 bottom
R29  40.64,21.91 90 bottom
R30  40.01,18.1 0 bottom
R31  38.1,21.91 90 bottom
R32  43.82,6.35 270 bottom
R33  46.04,6.67 90 bottom
R34  53.34,6.35 270 bottom
R35  59.37,18.42 270 top
R36  33.66,13.65 180 bottom
R37  31.75,9.53 90 bottom
R38  40.64,6.98 270 bottom
R39  47.62,6.03 180 top
R40  56.52,58.42 225 bottom
R41  57.15,60.96 225 bottom
R42  57.79,57.78 315 top
R43  57.79,62.86 315 top
R44  56.52,55.25 180 bottom
R45  57.15,50.16 225 bottom
R46  58.42,42.55 180 bottom
R47  58.42,40.01 180 bottom
R48  47.62,10.8 180 top
R50  32.07,41.91 90 top
R51  29.21,56.52 270 top
R52  56.52,66.67 0 top
R53  56.52,64.13 180 bottom
X5  65.41,36.2 90 top

### Tracks (layer width: path | path; a pad name or v marks a point on that pad's centre or on a via)
+3V3  (via drill 0.6)
  Top 0.305: R48.1 48.26,11.11 v48.26,13.33 74LVC245.20 | X5.B9 X5.A9 61.14,27.45 60.01,28.58 60.01,30.48 58.1,32.38 | 58.1,32.38 53.34,32.38 52.71,31.75 52.71,29.21 48.84,25.35 74LVC245.1 v48.26,23.18 | 58.1,32.38 59.05,32.38 v60.01,33.34
  Top 0.61: v37.47,35.88 C6.1 | PCB1.P9.3 PCB1.P9.4
  Bottom 0.305: v48.26,13.33 v48.26,23.18
  Bottom 0.61: PCB1.P9.3 13.21,64.13 C17.+ 15.05,64 22.86,56.2 29.53,56.2 33.97,51.75 33.97,48.26 36.2,46.04 36.2,37.15 v37.47,35.88 37.47,39.05 40.96,42.55 49.85,42.55 56.83,35.56 58.42,35.56 60.01,33.97 v60.01,33.34
+5V  (via drill 0.6)
  Top 0.305: v33.02,46.35 31.79,46.35 IC4.14 | v23.5,12.7 22.48,12.7 IC3.14
  Top 0.406: v20.95,53.34 C4.1
  Top 0.61: v33.02,46.35 33.02,45.99 C11.1 34.29,45.29 34.29,53.34 34.93,53.98 GND.1 38.74,53.98 40.01,55.25 40.01,59.05 42.55,61.59 44.45,61.59 45.72,62.86 45.72,64.77 46.99,66.04 v53.34,66.04 | C3.1 v17.78,19.69 17.78,20.32 15.24,22.86 11.43,22.86 8.89,20.32 8.89,15.24 v8.26,14.61
  Bottom 0.305: IC7.5 47.63,4.13 C13.1 | C14.1 32.07,6.35 33.02,7.3 34.26,7.3 IC8.5
  Bottom 0.61: IC2.4 v20.95,53.34 | v20.95,53.34 C4.1 14.88,61.63 C18.+ | v20.95,53.34 25.08,53.34 26.35,52.07 26.35,49.21 27.3,48.26 C2.1 28.26,47.31 29.21,46.36 31.75,46.36 v33.02,46.35 | C1.1 v23.5,12.7 23.5,12.06 24.77,10.8 24.77,7.62 | v17.78,19.69 IC1.4 | 52.07,64.77 IC10.1 51.33,65.82 C12.1 52.71,66.67 v53.34,66.04 | 53.44,65.94 v53.34,66.04 | 24.77,7.62 26.67,5.72 C14.1 32.07,4.12 33.02,3.17 39.69,3.17 40.96,1.91 45.41,1.91 C13.1 | 24.77,7.62 13.97,7.62 8.26,13.33 v8.26,14.61 7.62,15.24 3.17,15.24 0.64,17.78 0.64,57.78 1.91,59.05 PCB1.P9.7 PCB1.P9.8 8.26,61.59 9.48,61.59 | X5.B24 X5.A24 60.79,64.94 59.69,66.04 v53.34,66.04
  Bottom 0.813: 9.48,61.59 C18.+
AIN1  (via drill 0.6)
  Top 0.406: v20.32,10.8 v16.51,10.8
  Bottom 0.305: PCB1.P9.39 5.08,16.51 8.89,16.51 10.16,15.24 10.16,13.4 R5.2
  Bottom 0.406: IC1.14 21.59,12.64 21.59,11.75 20.64,10.8 v20.32,10.8 | v16.51,10.8 12.7,10.8 10.83,12.67 R5.2
AIN2
  Bottom 0.406: PCB1.P9.40 R11.2 9.21,17.46 11.43,15.24 12.7,15.24 13.33,14.61 17.78,14.61 19.05,15.88 IC1.1
AIN3
  Bottom 0.406: PCB1.P9.37 4.45,22.22 8.89,22.22 12.06,25.4 R17.2 21.91,28.26 27.62,28.26 29.21,26.67 29.21,24.77 27.94,23.49 IC1.8 24.13,23.49
AIN4
  Bottom 0.406: PCB1.P9.38 R23.2 9.84,21.91 10.79,22.86 11.43,22.86 12.06,23.49 IC1.7
AIN5
  Bottom 0.406: IC2.1 17.14,47.62 14.92,45.41 R8.2 10.16,41.59 8.26,41.59 7.3,40.64 7.3,33.02 3.17,28.89 PCB1.P9.33
AIN6
  Bottom 0.406: PCB1.P9.36 8.57,23.49 12.06,26.99 17.78,26.99 18.41,27.62 19.37,27.62 21.27,29.53 28.57,29.53 31.43,32.38 31.43,39.37 30.48,40.32 R14.2 29.53,40.32 29.53,42.23 28.57,43.18 25.4,43.18 24.82,43.76 24.82,45.02 IC2.8
AIN7
  Bottom 0.406: PCB1.P9.35 4.45,24.77 8.26,24.77 12.06,28.58 12.06,35.88 11.43,36.51 11.43,40.96 12.06,41.59 13.01,41.59 R20.2 13.02,42.55 14.29,43.81 16.51,43.81 17.14,44.45 IC2.14
ANA_IN1  (via drill 0.6)
  Top 0.406: v22.86,9.21 JP1.1
  Bottom 0.406: v22.86,9.21 19.15,9.21 R2.2
ANA_IN2
  Top 0.305: R9.2 14.61,8.89 JP2.1
ANA_IN3
  Top 0.406: R15.2 30.8,4.76 JP3.1
ANA_IN4
  Top 0.406: JP4.1 4.45,6.98 7.94,6.98 R21.2
ANA_IN5
  Top 0.305: R6.2 11.11,51.75 JP5.1
ANA_IN6
  Top 0.406: 25.72,36.12 JP6.1 26.04,33.34 R12.2
ANA_IN7  (via drill 0.6)
  Top 0.406: 16.83,33.34 16.76,33.18 | 16.76,33.18 16.34,32.19 | 16.34,32.19 JP7.1 | 16.76,33.27 16.76,33.18 | v19.68,36.2 19.68,33.97 18.73,33.02 17.17,33.02 16.34,32.19
  Bottom 0.406: R18.2 17.15,36.2 v19.68,36.2
ANA_OUT1  (via drill 0.6)
  Top 0.305: C7.1 58.74,5.72 JP8.1 45.72,4.44 v44.77,3.49
  Bottom 0.305: IC7.1 47.62,8.25 46.99,8.89 42.86,8.89 42.55,8.57 42.55,5.72 42.86,5.4 42.87,5.4 R32.2 43.82,4.44 v44.77,3.49
ANA_OUT2  (via drill 0.6)
  Top 0.406: v38.74,9.53 38.74,5.08 JP9.1
  Bottom 0.305: 36.83,11.43 39.69,11.43 C9.1 | 36.83,11.43 v38.74,9.53 | IC8.1 34.29,13.34 R36.2 35.88,13.65 36.83,12.7 36.83,11.43
DIG_IN1
  Bottom 0.305: R24.1 55.57,28.57 55.57,28.26 60.01,23.81 60.01,20.95 60.33,20.64 61.34,19.94 X5.A6
DIG_IN2
  Bottom 0.305: R25.1 46.68,20 46.99,20.32 46.99,24.13 47.31,24.45 49.53,24.45 53.98,20 58.1,20 58.74,19.37 58.74,17.14 60.96,14.92 62.88,14.92 X5.A4
DIG_IN3
  Bottom 0.305: R26.1 49.53,33.66 50.8,32.38 58.1,32.38 60.01,30.48 60.01,26.67 61.73,24.95 X5.A8
DIG_IN4
  Bottom 0.305: R27.1 43.2,19.35 44.77,17.78 44.77,12.38 45.72,11.43 49.21,11.43 50.17,12.38 50.17,13.97 50.8,14.61 59.69,14.61 61.91,12.38 62.84,12.38 X5.A3
DIG_IN5
  Bottom 0.305: X5.A7 62.01,22.45 60.64,23.81 60.64,24.77 55.88,29.53 51.12,29.53 50.49,29.52 47.95,29.52 47.31,30.16 41.91,30.16 R28.1
DIG_IN6
  Bottom 0.305: R29.1 41.28,20.96 41.91,21.59 41.91,24.77 42.23,25.08 50.17,25.08 53.98,21.27 58.42,21.27 59.69,20 59.69,18.42 60.64,17.46 62.89,17.46 X5.A5
DIG_IN7
  Bottom 0.305: R30.1 42.86,18.1 43.82,17.14 43.82,12.38 45.72,10.48 49.21,10.48 50.8,12.06 59.69,12.06 61.91,9.84 62.8,9.84 X5.A2
DIG_IN8
  Bottom 0.305: R31.1 38.1,19.69 37.47,19.05 37.47,17.14 38.42,16.19 42.23,16.19 43.18,15.24 43.18,12.06 45.4,9.84 49.85,9.84 50.48,9.21 52.07,9.21 53.02,10.16 59.05,10.16 61.77,7.44 X5.A1
DIG_OUT1
  Bottom 0.305: X5.A18 61.82,49.95 59.05,52.7 59.05,55.88 R40.2
  Bottom 0.406: X5.B18 X5.A18
DIG_OUT2
  Bottom 0.305: X5.A19 61.22,52.45 59.69,53.98 59.69,58.42 R41.2
  Bottom 0.406: X5.A19 X5.B19
DIG_OUT3
  Top 0.305: X5.A20 60.62,54.95 R42.2
  Bottom 0.406: X5.B20 X5.A20
DIG_OUT4
  Top 0.305: R43.2 58.46,60.29 61.3,57.45 X5.A21
  Bottom 0.406: X5.A21 X5.B21
DIG_OUT5
  Bottom 0.305: R44.2 57.47,52.71 59.69,50.16 59.69,48.26 60.51,47.45 X5.A17
  Bottom 0.406: X5.A17 X5.B17
DIG_OUT6
  Bottom 0.305: X5.A16 59.2,44.95 58.42,45.72 58.42,48.89 R45.2
  Bottom 0.406: X5.A16 X5.B16
DIG_OUT7
  Bottom 0.305: R46.2 62.8,42.55 X5.A15
  Bottom 0.406: X5.A15 X5.B15
DIG_OUT8
  Bottom 0.305: X5.A14 58.8,39.95 R47.2
  Bottom 0.406: X5.A14 X5.B14
DIN1  (via drill 0.6)
  Top 0.305: D1.C 48.26,27.3 v47.62,27.3 46.99,26.67 74LVC245.2
  Bottom 0.305: 47.95,27.3 v47.62,27.3 46.67,27.3 46.04,26.67 R24.2
DIN1_OE
  Top 0.305: 74LVC245.18 45.72,16.51 46.36,17.14 49.21,17.14 49.85,16.51 49.85,15.24 50.48,14.61 52.39,14.61 PCB1.P8.44
DIN2  (via drill 0.6)
  Top 0.305: D2.C 45.72,29.84 74LVC245.3 v45.72,23.49
  Bottom 0.305: R25.2 v45.72,23.49
DIN2_OE
  Top 0.305: 74LVC245.17 44.45,10.16 45.4,9.21 49.53,9.21 50.17,9.84 50.17,12.06 PCB1.P8.43
DIN3  (via drill 0.6)
  Top 0.305: 74LVC245.4 44.45,28.58 45.09,29.21 v45.09,32.07 45.09,32.7 44.45,33.34 D3.C
  Bottom 0.305: R26.2 45.09,32.7 v45.09,32.07
DIN3_OE
  Top 0.305: 74LVC245.16 43.18,10.48 45.4,8.25 50.48,8.25 51.44,9.21 PCB1.P8.45
DIN4  (via drill 0.6)
  Top 0.305: D4.C 74LVC245.5 v43.18,23.49
  Bottom 0.305: R27.2 43.17,23.48 v43.18,23.49
DIN4_OE
  Top 0.305: 74LVC245.15 41.91,18.73 42.55,19.37 47.94,19.37 PCB1.P8.41
DIN5  (via drill 0.6)
  Top 0.305: D5.C 40.96,29.84 R28.2 v41.91,27.3 74LVC245.6
  Bottom 0.305: R28.2 v41.91,27.3
DIN5_OE
  Top 0.305: 74LVC245.14 40.64,19.37 41.28,20 49.85,20 PCB1.P8.39
DIN6  (via drill 0.6)
  Top 0.305: 74LVC245.7 40.64,28.26 v39.37,29.53 39.37,31.16 D6.C
  Bottom 0.305: R29.2 40.64,28.26 v39.37,29.53
DIN6_OE
  Top 0.305: 74LVC245.13 39.37,20 40.01,20.64 51.75,20.64 PCB1.P8.40
DIN7  (via drill 0.6)
  Top 0.305: D7.C v38.42,27.94 39.37,26.99 74LVC245.8
  Bottom 0.305: v38.42,27.94 39.37,26.99 39.37,26.67 39.37,18.42 R30.2
DIN7_OE
  Top 0.305: 74LVC245.12 38.1,20.64 38.74,21.27 53.98,21.27 55.56,19.69 55.56,17.46 PCB1.P8.42
DIN8  (via drill 0.6)
  Top 0.305: 74LVC245.9 38.1,23.81 37.47,23.18 v36.51,23.18 35.88,23.81 D8.C
  Bottom 0.305: v36.51,23.18 37.78,23.18 R31.2
DIN8_OE
  Top 0.305: 74LVC245.11 36.83,20.64 38.1,21.91 49.21,21.91 51.44,24.13 PCB1.P8.33
DOUT1  (via drill 0.6)
  Top 0.305: v53.34,57.15 55.25,55.25 55.25,52.7 PCB1.P8.14
  Bottom 0.305: v53.34,57.15 IC10.7
DOUT2  (via drill 0.6)
  Top 0.305: PCB1.P8.16 54.61,48.89 56.52,50.8 56.52,56.52 v53.34,59.69
  Bottom 0.305: v53.34,59.69 IC10.5
DOUT3  (via drill 0.6)
  Top 0.305: v47.62,54.29 47.62,51.12 50.17,48.26 52.07,48.26 PCB1.P8.18
  Bottom 0.305: IC10.9 46.67,55.88 47.62,54.93 v47.62,54.29
DOUT4  (via drill 0.6)
  Top 0.305: PCB1.P8.12 52.71,52.7 52.71,50.48 52.07,49.85 50.17,49.85 48.9,51.12 48.9,54.93 47.62,56.2 v47.62,57.15
  Bottom 0.305: IC10.11 46.67,58.42 v47.62,57.15
DOUT5
  Top 0.305: GND.14 43.18,51.44 44.13,50.48 45.4,50.48 48.9,46.99 48.9,44.13 52.39,40.64 52.39,35.24 PCB1.P8.28
DOUT6
  Top 0.305: GND.11 46.99,47.62 47.94,46.67 47.94,43.81 51.12,40.64 51.12,33.97 PCB1.P8.27
DOUT7  (via drill 0.6)
  Top 0.305: v47.94,40.96 43.82,45.09 GND.9
  Bottom 0.305: v47.94,40.96 49.21,40.96 PCB1.P8.26
DOUT8
  Top 0.305: PCB1.P8.29 51.44,31.75 50.17,33.02 50.17,36.51 42.86,43.81 40.64,43.81 38.1,46.35 GND.7
EHRPWM1A
  Top 0.305: R35.1 59.37,22.54 58.42,23.49 PCB1.P8.36
EHRPWM1B
  Top 0.305: PCB1.P8.34 52.39,24.45 52.39,23.18 53.34,22.22 54.61,22.22 56.52,20.32 56.52,13.33 55.88,12.7 55.88,10.48 55.25,9.84 53.02,9.84 51.44,8.25 51.44,6.98 50.48,6.03 R39.1
EHRPWM2A  (via drill 0.6)
  Top 0.305: v43.18,59.69 41.91,58.42 41.91,56.52 43.18,55.25 45.09,55.25 46.36,53.98 46.36,50.8 49.53,47.62 49.53,44.77 50.48,43.81 PCB1.P8.19
  Bottom 0.305: IC10.14 43.82,62.23 43.18,61.59 v43.18,59.69
EHRPWM2B  (via drill 0.6)
  Top 0.305: PCB1.P8.13 51.44,60.96 52.71,62.23 v53.34,62.23
  Bottom 0.305: v53.34,62.23 IC10.3
GND  (via drill 0.6)
  Top 0.305: 27.89,51.75 IC4.7 | v27.94,53.34 27.89,53.34 | D4.A 44.18,31.07 42.23,33.02 42.23,34.38 D5.A
  Bottom 0.305: IC8.2 35.24,8.89 36.2,8.89 37.15,7.94 37.15,6.67 C10.2 | C13.2 48.58,5.4 47.94,6.03 46.67,6.03 46.46,5.82 R33.1 | IC7.2 48.58,7.3 49.53,6.35 50.48,6.35 50.8,6.03 50.8,3.5 C8.2
  Bottom 0.406: IC2.11 20.95,42.55 v20.64,42.23 20.32,41.91 C19.2 | C2.2 27.94,50.16 | 31.75,8.57 R37.1 | C8.2 C13.2 | C14.2 C10.2 36.2,5.08
  Bottom 0.61: C18.- 13.8,66.63 C17.- | R37.1 30.16,8.58 | 28.26,14.92 29.21,13.97
  Bottom 0.813: PCB1.P9.1 PCB1.P9.2 9.48,66.67 C18.-
  other vias: 27.3,19.05 11.43,46.99 17.14,66.04 23.5,60.96 29.84,60.96 36.2,60.96 36.2,56.52 3.81,57.15 3.81,53.98 3.81,45.72 3.81,39.37 3.81,33.02 10.16,29.84 8.26,27.94 57.79,37.46 12.7,59.69 35.56,11.75 33.97,16.51 33.97,19.69 39.37,50.16 28.57,9.53
  pour Bottom (isolate 0.406): 0,0 76.83,0 76.83,68.58 41.91,68.58 41.91,64.13 20.32,64.13 20.32,68.58 0,68.58 0,62.23
  pour Top (isolate 0.406): 0,68.58 20.32,68.58 20.32,64.13 41.91,64.13 41.91,68.58 76.83,68.58 76.83,0 0,0
N$1  (via drill 0.6)
  Top 0.305: IC4.2 31.14,48.92 29.53,47.31 24.45,47.31 24.13,47.62 v21.27,47.62 15.24,47.62 10.48,42.86 R3.2
  Bottom 0.406: IC2.5 22.22,48.58 v21.27,47.62
N$2
  Top 0.305: IC4.1 31.79,52.75 31.75,53.34 R1.2
N$3  (via drill 0.6)
  Top 0.305: IC3.1 28.32,13.71 26.35,11.75 21.91,11.75 v20.32,13.33
  Bottom 0.406: IC1.13 22.86,17.14 22.22,16.51 22.22,15.24 v20.32,13.33 19.68,12.7 18.41,12.7 | R4.2 18.41,12.7 | R2.1 18.41,12.7
N$4  (via drill 0.6)
  Top 0.305: IC4.4 29.84,50.16 28.89,49.21 25.72,49.21 24.45,50.48 20,50.48 18.41,52.07 | 18.41,52.07 v18.41,53.02 | R6.1 18.1,51.75 18.41,52.07
  Top 0.406: v18.41,53.02
  Bottom 0.406: v18.41,53.02 IC2.2 | 18.41,52.39 v18.41,53.02 | v18.41,53.02 16.19,53.02 R7.2
N$5  (via drill 0.6)
  Top 0.305: IC4.3 30.5,49.55 29.21,48.26 25.08,48.26 23.81,49.53 v13.97,49.53
  Bottom 0.406: R8.1 v13.97,49.53 13.97,50.8 R7.1
N$6  (via drill 0.6)
  Top 0.305: IC3.2 29.24,14.58 29.53,14.29 29.53,13.33 26.99,10.8 22.22,10.8 20.95,9.53 15.88,9.53 12.7,12.7 v13.02,12.7
  Bottom 0.406: R4.1 v13.02,12.7 13.02,12.95 R5.1
N$7  (via drill 0.6)
  Top 0.305: IC3.10 20.34,16.53 19.68,15.88 v16.83,15.88 15.56,15.88 12.7,18.73 11.43,18.73 10.79,18.1 10.79,12.7 R9.1
  Bottom 0.406: R10.2 15.56,15.88 v16.83,15.88 18.1,17.14 IC1.2
N$8  (via drill 0.6)
  Top 0.305: IC3.11 20.95,15.88 19.68,14.61 14.61,14.61 v12.38,16.83
  Bottom 0.305: 11.43,18.42 R11.1
  Bottom 0.406: v12.38,16.83 13.37,17.82 R10.1 13.02,18.42 11.43,18.42
N$9  (via drill 0.6)
  Top 0.305: IC4.10 29.2,43.8 v27.3,41.91 26.04,40.64 R13.2
  Bottom 0.305: 26.04,40.64 v27.3,41.91
  Bottom 0.406: IC2.9 23.5,43.5 26.04,40.64 R13.2
N$10  (via drill 0.6)
  Top 0.305: IC4.11 29.84,42.55 27.94,40.64 v27.94,38.1
  Bottom 0.406: R13.1 27.62,37.78 v27.94,38.1 29.21,38.1 R14.1
N$12  (via drill 0.6)
  Top 0.305: IC3.4 28.89,15.88 30.48,17.46 30.48,23.49 28.57,25.4 v27.3,25.4
  Bottom 0.406: R17.1 21.27,25.4 22.86,26.99 25.08,26.99 25.71,26.35 R16.1 v27.3,25.4
N$13  (via drill 0.6)
  Top 0.305: IC4.8 27.89,45.67 21.91,39.69 17.46,39.69 v16.83,40.32
  Bottom 0.305: R19.2 16.73,41.49 16.83,41.59
  Bottom 0.406: R18.1 v16.83,40.32 16.83,41.59 16.83,42.23 18.41,43.81 IC2.13
N$14  (via drill 0.6)
  Top 0.305: IC4.9 28.54,45.05 22.22,38.73 14.29,38.73 v13.02,37.46
  Bottom 0.406: R19.1 R20.1 v13.02,37.46
N$15  (via drill 0.6)
  Top 0.305: R21.1 9.84,10.16 9.84,19.37 12.06,21.59 13.97,21.59 v15.24,20.32 17.73,17.83 IC3.8
  Bottom 0.406: IC1.6 R22.2 | R22.2 15.88,21.91 | v15.24,20.32 15.55,20.64 R22.2
N$16  (via drill 0.6)
  Top 0.305: IC3.9 19.34,17.17 16.51,17.14 v13.33,20.32
  Bottom 0.406: R22.1 13.33,22.22 | 13.33,22.22 12.7,22.22 11.74,21.27 R23.1 | v13.33,20.32 13.33,22.22
N$25
  Bottom 0.305: IC7.4 49.53,5.37 48.23,6.67 46.99,6.67 46.04,7.62 R33.2 45.5,7.3 R32.1
N$26
  Bottom 0.305: R37.2 31.75,10.48 | R36.1 32.7,11.43 32.7,11.33 R37.2 | IC8.4 36.19,7.62 35.56,8.25 34.61,8.25 34.29,8.57 33.55,8.57 R37.2
N$27
  Bottom 0.305: R34.2 51.19,7.65 IC7.3
  Bottom 0.406: R34.2 53.34,3.5 C8.1
N$28  (via drill 0.6)
  Top 0.305: v53.34,8.25 54.29,9.21 55.88,9.21 56.83,10.16 56.83,12.38 57.47,13.02 C7.2 58.74,13.97 59.37,14.61 R35.2
  Bottom 0.305: R34.1 v53.34,8.25
N$29
  Bottom 0.305: 36.19,9.84 IC8.3 36.48,9.87 38.1,8.25 C10.1 | 38.42,6.03 40.54,6.03 R38.2
  Bottom 0.406: C10.1 38.42,6.03
N$30  (via drill 0.6)
  Top 0.305: R39.2 46.36,6.03 42.86,9.53 41.59,9.53 v41.28,9.21
  Bottom 0.305: R38.1 40.86,7.83 40.86,8.79 v41.28,9.21 41.59,9.53 42.86,9.53 42.86,10.16 C9.2
N$32
  Bottom 0.305: IC10.6 55.17,58.42 R40.1
N$33
  Bottom 0.305: IC10.4 55.81,60.96 R41.1
N$34  (via drill 0.6)
  Top 0.305: v43.18,57.15 49.53,63.5 53.98,63.5 55.25,62.23 55.25,60.33 R42.1
  Bottom 0.305: IC10.10 v43.18,57.15
N$35  (via drill 0.6)
  Top 0.305: v47.62,64.13 48.26,64.77 55.88,64.77 R43.1
  Bottom 0.305: IC10.12 46.99,59.69 47.62,60.33 v47.62,64.13
N$36  (via drill 0.6)
  Top 0.305: GND.15 43.82,52.7 v45.09,51.44
  Bottom 0.305: v45.09,51.44 47.94,51.44 50.8,53.98 52.07,53.98 53.66,55.56 55.25,55.56 R44.1
N$37  (via drill 0.6)
  Top 0.305: v44.45,48.89 GND.12
  Bottom 0.305: R45.1 54.61,52.7 50.48,52.7 46.36,48.89 v44.45,48.89
N$38  (via drill 0.6)
  Top 0.305: GND.10 v44.45,46.35
  Bottom 0.305: v44.45,46.35 46.99,46.35 51.12,50.16 54.61,50.16 57.47,47.3 R46.1
N$39  (via drill 0.6)
  Top 0.305: GND.6 v38.74,47.62
  Bottom 0.305: v38.74,47.62 41.91,44.45 46.36,44.45 49.53,47.62 54.61,47.62 55.56,46.99 55.56,41.27 56.52,40.01 R47.1
N$41  (via drill 0.6)
  Top 0.305: v43.18,63.5 43.18,66.67 43.82,67.31 54.93,67.31 R52.1
  Bottom 0.305: v43.18,63.5 IC10.15
N$42
  Bottom 0.305: IC10.2 52.71,63.5 53.34,64.13 R53.1
N$99  (via drill 0.6)
  Top 0.305: IC3.3 v30.78,15.22 30.16,15.24
  Top 0.406: R15.1 30.81,15.22 v30.78,15.22
  Bottom 0.406: v30.78,15.22 30.8,15.88 30.8,20.64 29.21,22.22 IC1.9 23.5,22.22 22.54,23.18 22.54,24.13 R16.2
OE  (via drill 0.6)
  Top 0.305: R48.2 46.99,11.43 74LVC245.19 46.99,13.65 v46.67,13.33 | v57.47,17.78 v57.47,22.22 | PCB1.P8.30 53.98,28.58 56.52,26.03 v56.52,25.08
  Bottom 0.305: v46.67,13.33 46.67,13.02 47.62,12.06 48.9,12.06 49.53,12.7 49.53,16.51 50.17,17.14 56.83,17.14 v57.47,17.78 | v57.47,22.22 57.47,24.13 v56.52,25.08
PWM_OUT1
  Top 0.406: R52.2 57.79,66.67 60.01,64.45 60.01,61.28 61.34,59.95 X5.A22 X5.B22
PWM_OUT2
  Bottom 0.406: X5.B23 X5.A23 60.11,62.45 58.42,64.13 R53.2
SW_IN_BIAS  (via drill 0.6)
  Top 0.305: PCB1.P9.16 5.71,43.81 7.94,41.59 10.79,41.59 15.24,46.04 v26.35,46.04 | R50.2 v32.07,44.45 31.14,44.45 IC4.13
  Bottom 0.305: v26.35,46.04 26.67,46.04 28.26,44.45 v32.07,44.45
SW_IN_FB
  Top 0.254: 33.02,53.98 32.38,54.61 30.8,54.61
  Top 0.305: PCB1.P9.14 5.71,55.88 7.62,57.78 16.51,57.78 19.68,54.61 19.68,52.7 20.95,51.44 25.08,51.44 26.35,50.16 28.57,50.16 29.21,50.8 29.21,51.8 IC4.5 | IC4.5 29.2,54.29 | 29.2,54.29 29.2,55.55 R51.2 | IC4.6 IC4.5 | 33.02,53.98 33.02,49.53 30.5,47.01 IC4.12 30.5,38.43 30.48,38.42 30.48,37.15 31.43,36.2 31.43,29.84 28.57,26.99 26.67,26.99 25.72,26.03 25.72,24.77 26.67,23.81 28.57,23.81 29.53,22.86 29.53,17.78 28.92,17.17 IC3.6 IC3.5 25.1,16.53 23.81,15.24 22.5,15.24 IC3.12 IC3.13 | 30.8,54.61 29.51,54.61 29.2,54.29
V_ADC_REF
  Bottom 0.406: R3.3 9.53,32.38 PCB1.P9.32
V_OFFSET  (via drill 0.6)
  Top 0.406: v20.32,30.48 20.32,28.58 22.54,26.35 C20.1 22.86,26.03 27.94,20.95 v28.26,20.95
  Bottom 0.305: v20.32,30.48 21.59,31.75 21.59,37.78 C19.1
  Bottom 0.406: IC1.12 IC1.3 17.14,18.42 16.51,19.05 16.51,20.32 17.14,20.95 IC1.5 IC1.10 v28.26,20.95 | IC2.3 IC2.12 19.68,43.18 18.41,41.91 18.41,39.37 19.36,38.42 C19.1 21.27,38.42 22.22,39.37 IC2.10 22.22,46.04 23.5,47.31 IC2.6 IC2.7

### Text on the board
Top: 5V | DAQ_BEAGLE | P2 | P1 | O8 | O7 | AIN5 | O6 | O5 | O4 | O3 | O2 | O1 | GND | AIN6 | 3V3 | AIN7 | I8 | I7 | I6 | I5 | I4 | I3 | I2 | I1 | CW-RS225 | AIN4 | AIN2 | AIN1 | AIN3 | AOUT2 | 21-10-2015 v3 | AOUT1
Bottom: E.Klemm, TU Berlin 2015 | GND